# Altium project MEA_CLDP.PrjPcb (part 2 of 2)

## Sheet hdmi_to_8pin_header_vstimp.SchDoc
size A4
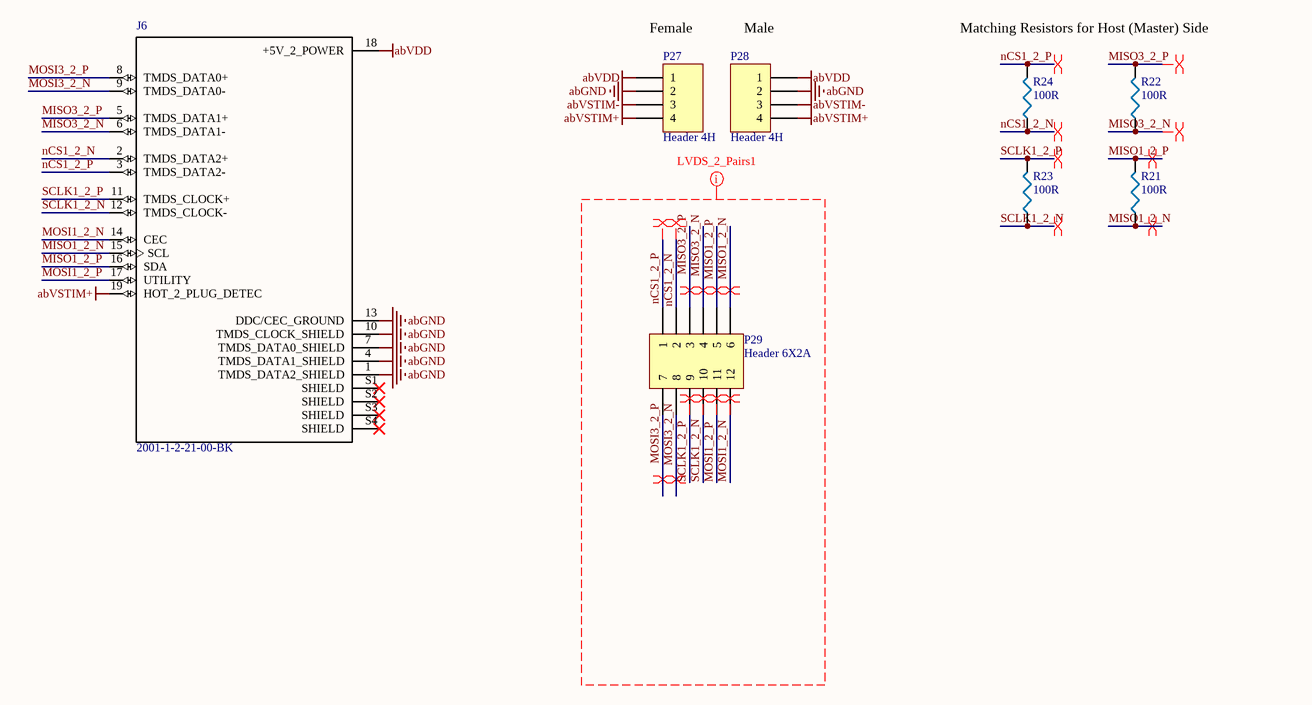
[diagram p6: hdmi_to_8pin_header_vstimp.SchDoc]

### Parts
J6  2001-1-2-21-00-BK  [*CNC_2001-1-2-21-00-BK_2001-1-2-21-00-BK(Primary)]
P27  Header 4H  [PPTC041LGBN-RC]
P28  Header 4H  [PEC04SBAN]
P29  Header 6X2A  [PPPC062LJBN-RC]
R21  100R  [R0805]
R22  100R  [R0805]
R23  100R  [R0805]
R24  100R  [R0805]

### Nets
abGND: J6.1(TMDS_DATA2_SHIELD) J6.4(TMDS_DATA1_SHIELD) J6.7(TMDS_DATA0_SHIELD) J6.10(TMDS_CLOCK_SHIELD) J6.13(DDC/CEC_GROUND) P27.2 P28.2
abVDD: J6.18(+5V_2_POWER) P27.1 P28.1
abVSTIM+: J6.19(HOT_2_PLUG_DETEC) P27.4 P28.4
abVSTIM-: P27.3 P28.3
MISO1_2_N: J6.15(SCL) P29.6 R21.1
MISO1_2_P: J6.16(SDA) P29.5 R21.2
MISO3_2_N: J6.6(TMDS_DATA1-) P29.4 R22.1
MISO3_2_P: J6.5(TMDS_DATA1+) P29.3 R22.2
MOSI1_2_N: J6.14(CEC) P29.12
MOSI1_2_P: J6.17(UTILITY) P29.11
MOSI3_2_N: J6.9(TMDS_DATA0-) P29.8
MOSI3_2_P: J6.8(TMDS_DATA0+) P29.7
nCS1_2_N: J6.2(TMDS_DATA2+) P29.2 R24.1
nCS1_2_P: J6.3(TMDS_DATA2-) P29.1 R24.2
SCLK1_2_N: J6.12(TMDS_CLOCK-) P29.10 R23.1
SCLK1_2_P: J6.11(TMDS_CLOCK+) P29.9 R23.2

Not connected (* = marked no-connect by the designer): J6 S1(SHIELD)* S2(SHIELD)* S3(SHIELD)* S4(SHIELD)*

### Layout directives
differential pair: MISO1_2_N, MISO1_2_P, MISO3_2_N, MISO3_2_P, MOSI1_2_N, MOSI1_2_P, MOSI3_2_N, MOSI3_2_P, nCS1_2_N, nCS1_2_P, SCLK1_2_N, SCLK1_2_P
net class LVDS_2_Pairs1: MISO1_2_N, MISO1_2_P, MISO3_2_N, MISO3_2_P, MOSI1_2_N, MOSI1_2_P, MOSI3_2_N, MOSI3_2_P, nCS1_2_N, nCS1_2_P, SCLK1_2_N, SCLK1_2_P

### Notes on the sheet
- (near P27) Female
- (near P28) Male
- Matching Resistors for Host (Master) Side

### Library data of the parts
J6 = 2001-1-2-21-00-BK: Mini Hdmi 19p Female Smt; Manufacturer: CNC Tech; Pricing1: Price Break  Unit Price  Extended Price  1  2.69000  $2.69  10  2.43900  $24.39  25  2.28960  $57.24  50  2.19000  $109.50  100  2.09050  $209.05  250  1.89140  $472.85  500  1.74208  $871.04 (CAD); Digi-Key_Part_Number: 1175-1704-1-ND; Digi-Key_Purchase_URL: https://www.digikey.com/product-detail/en/cnc-tech/2001-1-2-21-00-BK/1175-1704-1-ND/4867013?utm_source=snapeda&utm_medium=aggregator&utm_campaign=symbol; Manufacturer Part Number: 2001-1-2-21-00-BK; SnapEDA_Link: https://www.snapeda.com/parts/2001-1-2-21-00-BK/CNC%20Tech/view-part/?ref=snap; Supplier 1: Digikey; Supplier Part Number 1: 1175-1704-1-ND; Supplier Link 1: https://www.digikey.ca/product-detail/en/cnc-tech/2001-1-2-21-00-BK/1175-1704-1-ND/4867013; Stock1: 3,276; ComponentLink1URL: http://cnctech.us/pdfs/2001-1-2-21-00-BK.pdf; ComponentLink1Description: Datasheet
P27 = Header 4H: Header, 4-Pin, Right Angle; Manufacturer: Sullins Connector Solutions; Pricing1: Price Break  Unit Price  Extended Price  1  0.79000  $0.79  10  0.73700  $7.37  100  0.56490  $56.49  500  0.49124  $245.62  1,000  0.40528  $405.28  5,000  0.35615  $1,780.73  10,000  0.35478  $3,547.80 (CAD); Detailed Description: 4 Position Header Connector 0.100" (2.54mm) Through Hole, Right Angle Tin; LatestRevisionDate: 17-Jul-2002; LatestRevisionNote: Re-released for DXP Platform.; Publisher: Altium Limited; Manufacturer Part Number: PPTC041LGBN-RC; Manufacturer Link: https://www.sullinscorp.com/product/?pn=PPTC041LGBN-RC&toggle=in; Supplier 1: Digikey; Supplier Part Number 1: S5440-ND; Supplier Link 1: https://www.digikey.ca/product-detail/en/sullins-connector-solutions/PPTC041LGBN-RC/S5440-ND/775898; Stock1: 12,644; ComponentLink1URL: https://drawings-pdf.s3.amazonaws.com/10493.pdf; ComponentLink1Description: Datasheet
P28 = Header 4H: Header, 4-Pin, Right Angle; Manufacturer: Sullins Connector Solutions; pricing1: Price Break  Unit Price  Extended Price  1  0.54000  $0.54  10  0.50800  $5.08  25  0.43560  $10.89  50  0.37020  $18.51  100  0.35560  $35.56  250  0.31940  $79.85  500  0.30486  $152.43 (CAD); LatestRevisionDate: 17-Jul-2002; LatestRevisionNote: Re-released for DXP Platform.; Publisher: Altium Limited; Manufacturer Part Number: PEC04SBAN; Manufacturer Link: https://www.sullinscorp.com/product/?pn=PPPC181LFBN-RC&toggle=in#; Supplier 1: Digikey; Supplier Part Number 1: S1112E-04-ND; Supplier Link 1: https://www.digikey.ca/product-detail/en/sullins-connector-solutions/PEC04SBAN/S1112E-04-ND/860093; Stock1: 2,184; ComponentLink1URL: https://drawings-pdf.s3.amazonaws.com/10492.pdf; ComponentLink1Description: Datasheet
P29 = Header 6X2A: Header, 6-Pin, Dual row; Manufacturer: Sullins Connector Solutions; Pricing1: 1  1.80000  $1.80  10  1.57700  $15.77  100  1.36070  $136.07  500  1.11330  $556.65  1,000  0.98959  $989.59  5,000  0.89338  $4,466.92 (CAD); LatestRevisionDate: 17-Jul-2002; LatestRevisionNote: Re-released for DXP Platform.; Publisher: Altium Limited; Manufacturer Part Number: PPPC062LJBN-RC; Manufacturer Link: https://www.sullinscorp.com/product/?pn=PPPC062LJBN-RC&toggle=in; Supplier 1: Digikey; Supplier Link 1: https://www.digikey.ca/product-detail/en/sullins-connector-solutions/PPPC062LJBN-RC/S5559-ND/776017; Supplier Part Number 1: S5559-ND; Stock1: 7,855; ComponentLink1URL: https://drawings-pdf.s3.amazonaws.com/10494.pdf; ComponentLink1Description: Datasheet
R21-R24 = RES100: ERJ-6ENF1000V; Manufacturer: Panasonic Electronic Components; Tolerance: 1%; Temperature Coefficient: 100ppm/°C; Power Rating: 125mW; Voltage Rating: 150V; Supplier 1: Digi-Key; Manufacturer Part Number: ERJ-6ENF1000V; Stock 1: 1859281; Pricing 1: 1=0.16;  10=0.15;  100=0.05760;  1000=0.02535;  2500=0.02190  (CAD); Case/Package: 0805; Case Code (Metric): 2012; Case Code (Imperial): 0805; Min Operating Temperature: -55°C; Max Operating Temperature: 155°C; Resistance: 100R; Packaging: Paper Tape; Composition: Thick Film; Package Quantity: 1; Number of Terminations: 2; Termination: SMD/SMT; Military Standard: Not; Max Power Dissipation: 125mW; REACH SVHC: Unknown; Lead Free: Lead Free; ComponentLink1URL: https://industrial.panasonic.com/cdbs/www-data/pdf/RDA0000/AOA0000C304.pdf; ComponentLink1Description: Datasheet; ComponentLink2URL: https://industrial.panasonic.com/ww/products/resistors/chip-resistors/general-purpose-chip-resistors/precision-thick-film-chip-resistors/ERJ6ENF1000V; ComponentLink2Description: Specifications; Supplier Part Number 1: P100CCT-ND; Weight: 4mg; Length: 2mm; Width: 1.25mm; Supplier Link 1: https://www.digikey.ca/product-detail/en/panasonic-electronic-components/ERJ-6ENF1000V/P100CCT-ND/118668

## Nets that join several sheets
GND: MEA_CLDP (19 pins), A1 (11 pins), A2 (11 pins), A3 (11 pins), A4 (11 pins)
VDD: MEA_CLDP (J2.18 J3.18), A1 (6 pins), A2 (6 pins), A3 (6 pins), A4 (6 pins)
Vref: A1 (R20_A1.1 U1_A1.3), A2 (R20_A2.1 U1_A2.3), A3 (R20_A3.1 U1_A3.3), A4 (R20_A4.1 U1_A4.3)
VSTIM+: MEA_CLDP (J2.19 P18.3), A1 (C3_A1.2 U1_A1.6 U1_A1.7), A2 (C3_A2.2 U1_A2.6 U1_A2.7), A3 (C3_A3.2 U1_A3.6 U1_A3.7), A4 (C3_A4.2 U1_A4.6 U1_A4.7)
VSTIM-: MEA_CLDP (J3.19 P18.4), A1 (C4_A1.2 U1_A1.4 U1_A1.5 U1_A1.CENTER), A2 (C4_A2.2 U1_A2.4 U1_A2.5 U1_A2.CENTER), A3 (C4_A3.2 U1_A3.4 U1_A3.5 U1_A3.CENTER), A4 (C4_A4.2 U1_A4.4 U1_A4.5 U1_A4.CENTER)
ELEC0: MEA_CLDP (P10.9), A1 (U1_A1.44)
ELEC0: MEA_CLDP (P10.17), A2 (U1_A2.44)
ELEC0: MEA_CLDP (P13.2), A3 (U1_A3.44)
ELEC0: MEA_CLDP (P13.10), A4 (U1_A4.44)
ELEC1: MEA_CLDP (P11.9), A1 (U1_A1.43)
ELEC1: MEA_CLDP (P11.17), A2 (U1_A2.43)
ELEC1: MEA_CLDP (P12.2), A3 (U1_A3.43)
ELEC1: MEA_CLDP (P12.10), A4 (U1_A4.43)
ELEC2: MEA_CLDP (P10.8), A1 (U1_A1.42)
ELEC2: MEA_CLDP (P10.16), A2 (U1_A2.42)
ELEC2: MEA_CLDP (P13.3), A3 (U1_A3.42)
ELEC2: MEA_CLDP (P13.11), A4 (U1_A4.42)
ELEC3: MEA_CLDP (P11.8), A1 (U1_A1.41)
ELEC3: MEA_CLDP (P11.16), A2 (U1_A2.41)
ELEC3: MEA_CLDP (P12.3), A3 (U1_A3.41)
ELEC3: MEA_CLDP (P12.11), A4 (U1_A4.41)
ELEC4: MEA_CLDP (P10.7), A1 (U1_A1.40)
ELEC4: MEA_CLDP (P10.15), A2 (U1_A2.40)
ELEC4: MEA_CLDP (P13.4), A3 (U1_A3.40)
ELEC4: MEA_CLDP (P13.12), A4 (U1_A4.40)
ELEC5: MEA_CLDP (P11.7), A1 (U1_A1.39)
ELEC5: MEA_CLDP (P11.15), A2 (U1_A2.39)
ELEC5: MEA_CLDP (P12.4), A3 (U1_A3.39)
ELEC5: MEA_CLDP (P12.12), A4 (U1_A4.39)
ELEC6: MEA_CLDP (P10.6), A1 (U1_A1.38)
ELEC6: MEA_CLDP (P10.14), A2 (U1_A2.38)
ELEC6: MEA_CLDP (P13.5), A3 (U1_A3.38)
ELEC6: MEA_CLDP (P13.13), A4 (U1_A4.38)
ELEC7: MEA_CLDP (P11.6), A1 (U1_A1.37)
ELEC7: MEA_CLDP (P11.14), A2 (U1_A2.37)
ELEC7: MEA_CLDP (P12.5), A3 (U1_A3.37)
ELEC7: MEA_CLDP (P12.13), A4 (U1_A4.37)
ELEC8: MEA_CLDP (P10.5), A1 (U1_A1.36)
ELEC8: MEA_CLDP (P10.13), A2 (U1_A2.36)
ELEC8: MEA_CLDP (P13.6), A3 (U1_A3.36)
ELEC8: MEA_CLDP (P13.14), A4 (U1_A4.36)
ELEC9: MEA_CLDP (P11.5), A1 (U1_A1.35)
ELEC9: MEA_CLDP (P11.13), A2 (U1_A2.35)
ELEC9: MEA_CLDP (P12.6), A3 (U1_A3.35)
ELEC9: MEA_CLDP (P12.14), A4 (U1_A4.35)
ELEC10: MEA_CLDP (P10.4), A1 (U1_A1.34)
ELEC10: MEA_CLDP (P10.12), A2 (U1_A2.34)
ELEC10: MEA_CLDP (P13.7), A3 (U1_A3.34)
ELEC10: MEA_CLDP (P13.15), A4 (U1_A4.34)
ELEC11: MEA_CLDP (P11.4), A1 (U1_A1.33)
ELEC11: MEA_CLDP (P11.12), A2 (U1_A2.33)
ELEC11: MEA_CLDP (P12.7), A3 (U1_A3.33)
ELEC11: MEA_CLDP (P12.15), A4 (U1_A4.33)
ELEC12: MEA_CLDP (P10.3), A1 (U1_A1.32)
ELEC12: MEA_CLDP (P10.11), A2 (U1_A2.32)
ELEC12: MEA_CLDP (P13.8), A3 (U1_A3.32)
ELEC12: MEA_CLDP (P13.16), A4 (U1_A4.32)
ELEC13: MEA_CLDP (P11.3), A1 (U1_A1.31)
ELEC13: MEA_CLDP (P11.11), A2 (U1_A2.31)
ELEC13: MEA_CLDP (P12.8), A3 (U1_A3.31)
ELEC13: MEA_CLDP (P12.16), A4 (U1_A4.31)
ELEC14: MEA_CLDP (P10.2), A1 (U1_A1.30)
ELEC14: MEA_CLDP (P10.10), A2 (U1_A2.30)
ELEC14: MEA_CLDP (P13.9), A3 (U1_A3.30)
ELEC14: MEA_CLDP (P13.17), A4 (U1_A4.30)
ELEC15: MEA_CLDP (P11.2), A1 (U1_A1.29)
ELEC15: MEA_CLDP (P11.10), A2 (U1_A2.29)
ELEC15: MEA_CLDP (P12.9), A3 (U1_A3.29)
ELEC15: MEA_CLDP (P12.17), A4 (U1_A4.29)
MISO1h_N: MEA_CLDP (J2.15), A1 (U1_A1.20)
MISO1h_P: MEA_CLDP (J2.16), A1 (U1_A1.21)
MISO2h_N: MEA_CLDP (J3.15), A2 (U1_A2.20)
MISO2h_P: MEA_CLDP (J3.16), A2 (U1_A2.21)
MISO3h_N: MEA_CLDP (J2.6), A3 (U1_A3.20)
MISO3h_P: MEA_CLDP (J2.4), A3 (U1_A3.21)
MISO4h_N: MEA_CLDP (J3.6), A4 (U1_A4.20)
MISO4h_P: MEA_CLDP (J3.4), A4 (U1_A4.21)
MOSI1h_N: MEA_CLDP (J2.13 R3.1), A1 (U1_A1.18)
MOSI1h_P: MEA_CLDP (J2.14 R3.2), A1 (U1_A1.19)
MOSI2h_N: MEA_CLDP (J3.13 R5.1), A2 (U1_A2.18)
MOSI2h_P: MEA_CLDP (J3.14 R5.2), A2 (U1_A2.19)
MOSI3h_N: MEA_CLDP (J2.9 R9.1), A3 (U1_A3.18)
MOSI3h_P: MEA_CLDP (J2.7 R9.2), A3 (U1_A3.19)
MOSI4h_N: MEA_CLDP (J3.9 R19.1), A4 (U1_A4.18)
MOSI4h_P: MEA_CLDP (J3.7 R19.2), A4 (U1_A4.19)
nCS1h_N: MEA_CLDP (J2.1), A1 (U1_A1.14), A3 (U1_A3.14)
nCS1h_P: MEA_CLDP (J2.3), A1 (U1_A1.15), A3 (U1_A3.15)
nCS2h_N: MEA_CLDP (J3.1), A2 (U1_A2.14), A4 (U1_A4.14)
nCS2h_P: MEA_CLDP (J3.3), A2 (U1_A2.15), A4 (U1_A4.15)
SCLK1h_N: MEA_CLDP (J2.12), A1 (U1_A1.16), A3 (U1_A3.16)
SCLK1h_P: MEA_CLDP (J2.10), A1 (U1_A1.17), A3 (U1_A3.17)
SCLK2h_N: MEA_CLDP (J3.12), A2 (U1_A2.16), A4 (U1_A4.16)
SCLK2h_P: MEA_CLDP (J3.10), A2 (U1_A2.17), A4 (U1_A4.17)